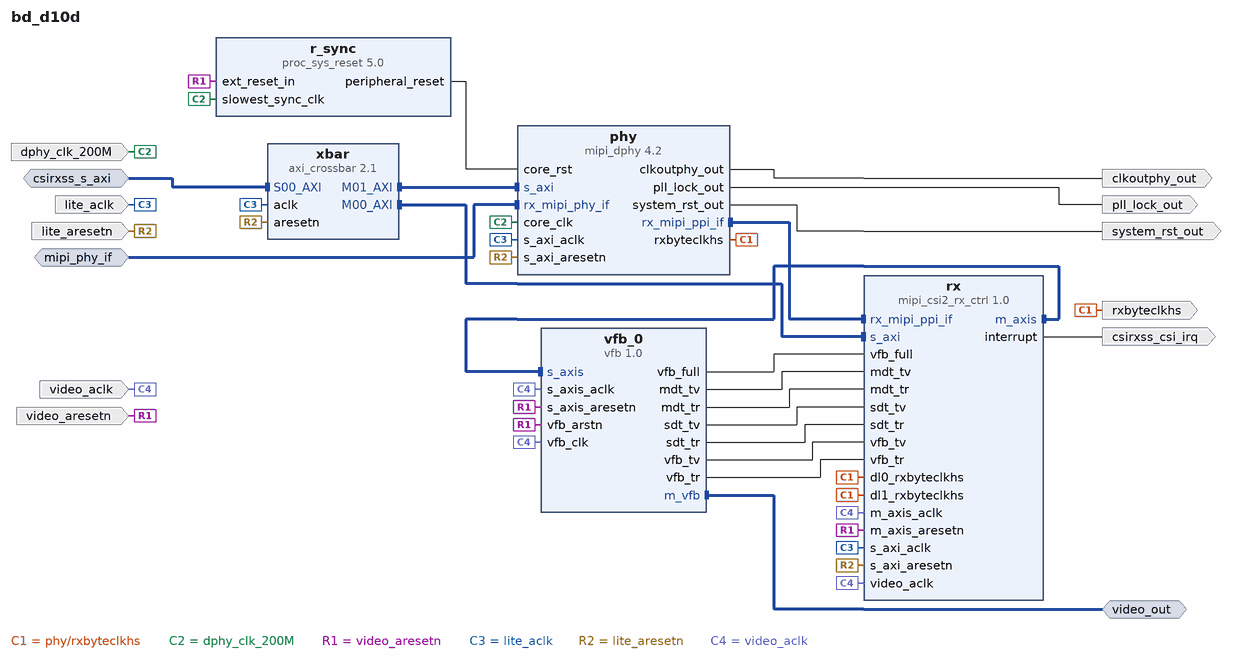
[diagram p0: block diagram of the top level]
# Vivado block design bd_d10d, xczu5ev-sfvc784-1-i, Vivado 2020.1
create_bd_design bd_d10d

create_bd_intf_port -mode Slave -vlnv xilinx.com:interface:mipi_phy_rtl:1.0 mipi_phy_if
create_bd_intf_port -mode Slave -vlnv xilinx.com:interface:aximm_rtl:1.0 csirxss_s_axi
set_property -dict {CONFIG.DATA_WIDTH 32 CONFIG.PROTOCOL AXI4LITE} [get_bd_intf_ports csirxss_s_axi]
create_bd_intf_port -mode Master -vlnv xilinx.com:interface:axis_rtl:1.0 video_out
create_bd_port -dir I -type clk lite_aclk
set_property -dict {CONFIG.ASSOCIATED_BUSIF csirxss_s_axi CONFIG.ASSOCIATED_RESET lite_aresetn} [get_bd_ports lite_aclk]
create_bd_port -dir I -type rst lite_aresetn
set_property -dict {CONFIG.POLARITY ACTIVE_LOW} [get_bd_ports lite_aresetn]
create_bd_port -dir I -type clk dphy_clk_200M
create_bd_port -dir O -type clk rxbyteclkhs
create_bd_port -dir O -type clk clkoutphy_out
create_bd_port -dir O -type rst system_rst_out
create_bd_port -dir O pll_lock_out
create_bd_port -dir O -type intr csirxss_csi_irq
create_bd_port -dir I -type clk video_aclk
set_property -dict {CONFIG.ASSOCIATED_BUSIF video_out CONFIG.ASSOCIATED_RESET video_aresetn} [get_bd_ports video_aclk]
create_bd_port -dir I -type rst video_aresetn
set_property -dict {CONFIG.POLARITY ACTIVE_LOW} [get_bd_ports video_aresetn]

create_bd_cell -type ip -vlnv xilinx.com:ip:axi_crossbar:2.1 xbar
set_property -dict [list \
  CONFIG.ADDR_WIDTH 13 \
  CONFIG.DATA_WIDTH 32 \
  CONFIG.M00_A00_ADDR_WIDTH 12 \
  CONFIG.M00_A00_BASE_ADDR 0x0000000000000000 \
  CONFIG.M01_A00_ADDR_WIDTH 12 \
  CONFIG.M01_A00_BASE_ADDR 0x0000000000001000 \
  CONFIG.NUM_MI 2 \
  CONFIG.PROTOCOL AXI4LITE \
  CONFIG.R_REGISTER 1 \
] [get_bd_cells xbar]
create_bd_cell -type ip -vlnv xilinx.com:ip:proc_sys_reset:5.0 r_sync
create_bd_cell -type ip -vlnv xilinx.com:ip:mipi_csi2_rx_ctrl:1.0 rx
set_property -dict [list \
  CONFIG.AXIS_FIFO_DEPTH 2048 \
  CONFIG.AXIS_TDATA_WIDTH 64 \
  CONFIG.AXIS_TDEST_WIDTH 4 \
  CONFIG.AXIS_TUSER_WIDTH 96 \
  CONFIG.CSI_EN_VC_SUPPORT 1 \
  CONFIG.CSI_INV_SHUTDOWN 1 \
  CONFIG.CSI_LANES 2 \
  CONFIG.CSI_OFFLOAD_NONIMAGE 0 \
  CONFIG.C_CSI2RX_DBG 0 \
  CONFIG.C_CSI_FILTER_USERDATATYPE false \
  CONFIG.C_CSI_OPT1_REGS false \
  CONFIG.C_CSI_OPT2_CRC false \
  CONFIG.C_CSI_OPT3_FIXEDLANES true \
  CONFIG.C_DISABLE_LITE false \
  CONFIG.C_EN_CSI_V2_0 false \
  CONFIG.C_EN_VCX false \
  CONFIG.C_HS_LINE_RATE 1000 \
  CONFIG.C_IS_7SERIES false \
  CONFIG.C_MIPI_SLV_INT 0 \
  CONFIG.C_RCVE_DESKEW_SEQ false \
  CONFIG.HP_IO_BANK_SELECTION 65 \
] [get_bd_cells rx]
create_bd_cell -type ip -vlnv xilinx.com:ip:mipi_dphy:4.2 phy
set_property -dict [list \
  CONFIG.CLK_LANE_IO_LOC W8 \
  CONFIG.C_CLK_IO_SWAP false \
  CONFIG.C_DL0_IO_SWAP false \
  CONFIG.C_DL1_IO_SWAP false \
  CONFIG.C_DL2_IO_SWAP false \
  CONFIG.C_DL3_IO_SWAP false \
  CONFIG.C_DPHY_LANES 2 \
  CONFIG.C_DPHY_MODE SLAVE \
  CONFIG.C_EN_CNTS_BYTE_CLK false \
  CONFIG.C_EN_REG_IF true \
  CONFIG.C_EN_TIMEOUT_REGS false \
  CONFIG.C_ESC_TIMEOUT 25600 \
  CONFIG.C_FIFO_RD_EN_CONTROL true \
  CONFIG.C_HS_LINE_RATE 1000 \
  CONFIG.C_HS_SETTLE_NS 145 \
  CONFIG.C_HS_TIMEOUT 65541 \
  CONFIG.C_IDLY_GROUP_NAME mipi_csi2rx_idly_group \
  CONFIG.C_INIT 100000 \
  CONFIG.C_LPRX_DISABLE_EXTPORT 0 \
  CONFIG.C_RCVE_ALT_DESKEW_SEQ false \
  CONFIG.C_RCVE_DESKEW_SEQ false \
  CONFIG.C_STRETCH_LINE_RATE 3500 \
  CONFIG.DATA_LANE0_IO_LOC U9 \
  CONFIG.DATA_LANE1_IO_LOC U8 \
  CONFIG.DPHY_PRESET CSI2RX_XLNX \
  CONFIG.HP_IO_BANK_SELECTION 65 \
  CONFIG.SupportLevel 1 \
] [get_bd_cells phy]
create_bd_cell -type ip -vlnv xilinx.com:ip:vfb:1.0 vfb_0
set_property -dict [list \
  CONFIG.AXIS_TDATA_WIDTH 64 \
  CONFIG.C_HS_LINE_RATE 1000 \
  CONFIG.VFB_DATA_TYPE RAW10 \
  CONFIG.VFB_FIFO_DEPTH 2048 \
  CONFIG.VFB_FILTER_VC 0 \
  CONFIG.VFB_OP_PIXELS 1 \
  CONFIG.VFB_TU_WIDTH 1 \
] [get_bd_cells vfb_0]

# ---- connections ----

connect_bd_intf_net [get_bd_intf_pins phy/rx_mipi_ppi_if] [get_bd_intf_pins rx/rx_mipi_ppi_if]
connect_bd_intf_net [get_bd_intf_pins xbar/M00_AXI] [get_bd_intf_pins rx/s_axi]
connect_bd_intf_net [get_bd_intf_pins xbar/M01_AXI] [get_bd_intf_pins phy/s_axi]
connect_bd_intf_net [get_bd_intf_pins rx/m_axis] [get_bd_intf_pins vfb_0/s_axis]
connect_bd_intf_net [get_bd_intf_ports csirxss_s_axi] [get_bd_intf_pins xbar/S00_AXI]
connect_bd_intf_net [get_bd_intf_ports video_out] [get_bd_intf_pins vfb_0/m_vfb]
connect_bd_intf_net [get_bd_intf_ports mipi_phy_if] [get_bd_intf_pins phy/rx_mipi_phy_if]
connect_bd_net [get_bd_pins rx/interrupt] [get_bd_ports csirxss_csi_irq]
connect_bd_net [get_bd_pins phy/rxbyteclkhs] [get_bd_pins rx/dl0_rxbyteclkhs] [get_bd_pins rx/dl1_rxbyteclkhs] [get_bd_ports rxbyteclkhs]
connect_bd_net [get_bd_ports dphy_clk_200M] [get_bd_pins r_sync/slowest_sync_clk] [get_bd_pins phy/core_clk]
connect_bd_net [get_bd_ports video_aresetn] \
  [get_bd_pins r_sync/ext_reset_in] [get_bd_pins rx/m_axis_aresetn] [get_bd_pins vfb_0/s_axis_aresetn] \
  [get_bd_pins vfb_0/vfb_arstn]
connect_bd_net [get_bd_pins r_sync/peripheral_reset] [get_bd_pins phy/core_rst]
connect_bd_net [get_bd_ports lite_aclk] [get_bd_pins xbar/aclk] [get_bd_pins rx/s_axi_aclk] [get_bd_pins phy/s_axi_aclk]
connect_bd_net [get_bd_ports lite_aresetn] [get_bd_pins xbar/aresetn] [get_bd_pins rx/s_axi_aresetn] [get_bd_pins phy/s_axi_aresetn]
connect_bd_net [get_bd_pins vfb_0/vfb_full] [get_bd_pins rx/vfb_full]
connect_bd_net [get_bd_pins vfb_0/mdt_tv] [get_bd_pins rx/mdt_tv]
connect_bd_net [get_bd_pins vfb_0/mdt_tr] [get_bd_pins rx/mdt_tr]
connect_bd_net [get_bd_pins vfb_0/sdt_tv] [get_bd_pins rx/sdt_tv]
connect_bd_net [get_bd_pins vfb_0/sdt_tr] [get_bd_pins rx/sdt_tr]
connect_bd_net [get_bd_pins vfb_0/vfb_tv] [get_bd_pins rx/vfb_tv]
connect_bd_net [get_bd_pins vfb_0/vfb_tr] [get_bd_pins rx/vfb_tr]
connect_bd_net [get_bd_ports video_aclk] \
  [get_bd_pins rx/m_axis_aclk] [get_bd_pins vfb_0/s_axis_aclk] [get_bd_pins vfb_0/vfb_clk] [get_bd_pins rx/video_aclk]
connect_bd_net [get_bd_pins phy/clkoutphy_out] [get_bd_ports clkoutphy_out]
connect_bd_net [get_bd_pins phy/system_rst_out] [get_bd_ports system_rst_out]
connect_bd_net [get_bd_pins phy/pll_lock_out] [get_bd_ports pll_lock_out]

# ---- address map ----
assign_bd_address -offset 0x00000000 -range 4K -target_address_space [get_bd_addr_spaces csirxss_s_axi] [get_bd_addr_segs rx/s_axi/reg0]
assign_bd_address -offset 0x00001000 -range 4K -target_address_space [get_bd_addr_spaces csirxss_s_axi] [get_bd_addr_segs phy/s_axi/Reg]

validate_bd_design
save_bd_design
